# EAGLE design microtb_utfpr_v1 (EAGLE 9.6.2)
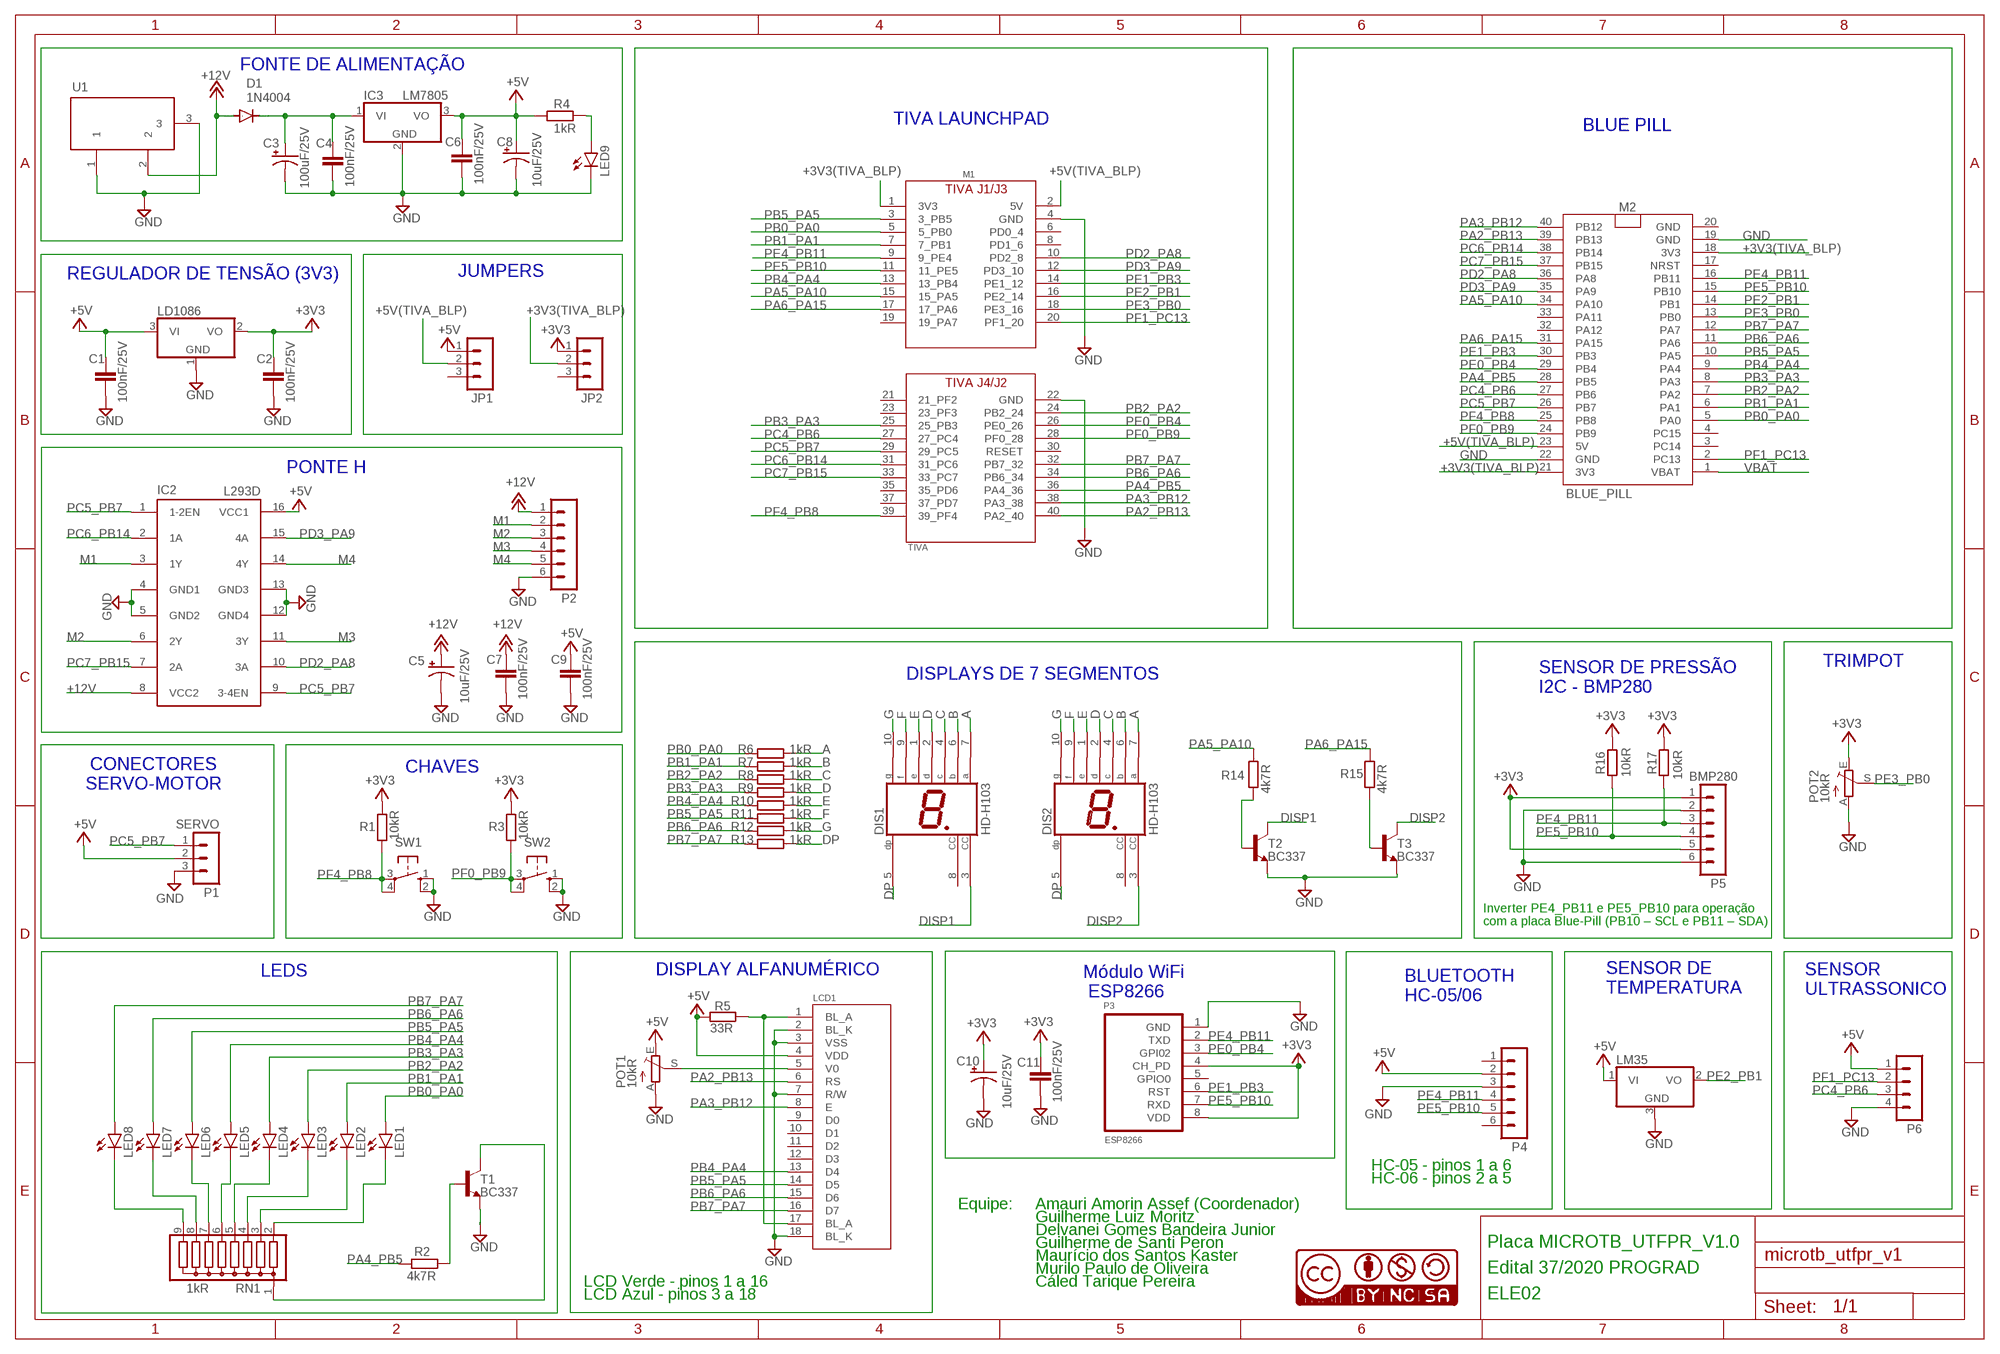
[diagram p0: schematic, sheet 1]

## Parts
C1  100nF/25V  C2.5/2  [C2.5-2]
C2  100nF/25V  C2.5/2  [C2.5-2]
C3  100uF/25V  CAPACITOR-PE2.5-7  [E2,5-7]
C4  100nF/25V  C2.5/2  [C2.5-2]
C5  10uF/25V  CAPACITOR-PE2.5-6  [E2,5-6]
C6  100nF/25V  C2.5/2  [C2.5-2]
C7  100nF/25V  C2.5/2  [C2.5-2]
C8  10uF/25V  CAPACITOR-PE2.5-6  [E2,5-6]
C9  100nF/25V  C2.5/2  [C2.5-2]
C10  10uF/25V  CAPACITOR-PE2.5-6  [E2,5-6]
C11  100nF/25V  C2.5/2  [C2.5-2]
D1  1N4004  [DO41-10]
DIS1  HD-H103  [HDSP-M]
DIS2  HD-H103  [HDSP-M]
IC1  LD1086  LD108605TV  [LD1086]
IC2  L293D  [DIL16]
IC3  LM7805  786TV  [TO220V]
JP1  JP  JUMP  [MA03-1]
JP2  JP  JUMP  [MA03-1]
LCD1  DISPLAY_LCDDISPLAY_LCD1  [DISPLAY_LCD_BL]
LED1  GREEN  LED3MM  [LED3MM]
LED2  GREEN  LED3MM  [LED3MM]
LED3  GREEN  LED3MM  [LED3MM]
LED4  GREEN  LED3MM  [LED3MM]
LED5  GREEN  LED3MM  [LED3MM]
LED6  GREEN  LED3MM  [LED3MM]
LED7  GREEN  LED3MM  [LED3MM]
LED8  GREEN  LED3MM  [LED3MM]
LED9  RED  LED3MM  [LED3MM]
M1  TIVA  [TIVA]
M2  BLUE_PILL  [BLUE_PILL]
P1  SERVO  CON3  [MA03-1]
P2  Motor  MA06-1  [HC_BLUETOOTH]
P3  ESP8266  [ESP8266]
P4  HC05_06  [HC_BLUETOOTH]
P5  BMP280  [BMP280]
P6  HC-04  HC-SR04US  [HS-04]
POT1  10kR  TRIM_EU-ELE02CA6V  [CA6V]
POT2  10kR  TRIM_EU-CIP20C-4MM  [CIP20C-4MM]
Q1  LM35L05Z  [LM35]
R1  10kR  R-EU_0204/7  [0204/7]
R2  4k7R  R-EU_0204/7  [0204/7]
R3  10kR  R-EU_0204/7  [0204/7]
R4  1kR  R-EU_0204/7  [0204/7]
R5  33R  R-EU_0204/7  [0204/7]
R6  1kR  R-EU_0204/7  [0204/7]
R7  1kR  R-EU_0204/7  [0204/7]
R8  1kR  R-EU_0204/7  [0204/7]
R9  1kR  R-EU_0204/7  [0204/7]
R10  1kR  R-EU_0204/7  [0204/7]
R11  1kR  R-EU_0204/7  [0204/7]
R12  1kR  R-EU_0204/7  [0204/7]
R13  1kR  R-EU_0204/7  [0204/7]
R14  4k7R  R-EU_0204/7  [0204/7]
R15  4k7R  R-EU_0204/7  [0204/7]
R16  10kR  R-EU_0204/7  [0204/7]
R17  10kR  R-EU_0204/7  [0204/7]
RN1  1kR  G08R  [SIL9]
SW1  SW  10-XX  [B3F-10XX]
SW2  SW  10-XX  [B3F-10XX]
T1  BC337  BC337-16-NPN-TO92-CBE  [TO92-CBE]
T2  BC337  BC337-16-NPN-TO92-CBE  [TO92-CBE]
T3  BC337  BC337-16-NPN-TO92-CBE  [TO92-CBE]
U1  POWERSUPPLY_DC21MMX  [POWERSUPPLY_DC-21MM]
U$1  CC-NC-BC  [CC-NC-BY]

## Nets
+3V3 [vcc]: C2.1 C10.+ C11.1 IC1.2(VO) JP2.1 P3.4(CH_PD) P3.8(VDD) P5.1 P5.5 POT2.E R1.2 R3.2 R16.2 R17.2
+3V3(TIVA_BLP) [vcctiva]: JP2.2 M1.1(3V3) M2.18(3V3) M2.21(3V3)
+5V [vcc]: C1.1 C6.1 C8.+ C9.1 IC1.3(VI) IC2.16(VCC1) IC3.3(VO) JP1.1 LCD1.4(VDD) P1.2 P4.2 P6.1 POT1.E Q1.1(VI) R4.1 R5.2
+5V(TIVA_BLP) [vcctiva]: JP1.2 M1.2(5V) M2.23(5V)
+12V [vcc]: C5.+ C7.1 D1.A IC2.8(VCC2) P2.1 U1.2
+V [vcc]: C3.+ C4.1 D1.C IC3.1(VI)
A: DIS1.7(A) DIS2.7(A) R6.1
B: DIS1.6(B) DIS2.6(B) R7.1
C: DIS1.4(C) DIS2.4(C) R8.1
D: DIS1.2(D) DIS2.2(D) R9.1
DISP1: DIS1.3(CC) T2.C
DISP2: DIS2.3(CC) T3.C
DP: DIS1.5(DP) DIS2.5(DP) R13.1
E: DIS1.1(E) DIS2.1(E) R10.1
F: DIS1.9(F) DIS2.9(F) R11.1
G: DIS1.10(G) DIS2.10(G) R12.1
GND [ground]: C1.2 C2.2 C3.- C4.2 C5.- C6.2 C7.2 C8.- C9.2 C10.- C11.2 IC1.1(GND) IC2.4(GND1) IC2.5(GND2) IC2.12(GND4) IC2.13(GND3) IC3.2(GND) LCD1.2(BL_K) LCD1.3(VSS) LCD1.7(R/W) LCD1.18(BL_K) LED9.K(C) M1.4(GND) M1.22(GND) M2.19(GND) M2.22(GND) P1.3 P2.6 P3.1(GND) P4.3 P5.2 P5.6 P6.4 POT1.A POT2.A Q1.3(GND) SW1.1(S) SW1.2(S1) SW2.1(S) SW2.2(S1) T1.E T2.E T3.E U1.1 U1.3
M1: IC2.3(1Y) P2.2
M2: IC2.6(2Y) P2.3
M3: IC2.11(3Y) P2.4
M4: IC2.14(4Y) P2.5
N$1: LED8.K(C) RN1.9
N$2: R14.1 T2.B
N$4: R15.1 T3.B
N$5 [vcc]: LED9.A R4.2
N$15: R2.2 T1.B
N$18: LED7.K(C) RN1.8
N$22: LED6.K(C) RN1.7
N$24: LED5.K(C) RN1.6
N$25: LED4.K(C) RN1.5
N$26: LED3.K(C) RN1.4
N$27: LED2.K(C) RN1.3
N$28: LED1.K(C) RN1.2
N$30: LCD1.1(BL_A) LCD1.17(BL_A) R5.1
N$31: RN1.1 T1.C
PA2_PB13: LCD1.6(RS) M1.40(PA2_40) M2.39(PB13)
PA3_PB12: LCD1.8(E) M1.38(PA3_38) M2.40(PB12)
PA4_PB5: M1.36(PA4_36) M2.28(PB5) R2.1
PA5_PA10: M1.15(15_PA5) M2.34(PA10) R14.2
PA6_PA15: M1.17(17_PA6) M2.31(PA15) R15.2
PB0_PA0: LED1.A M1.5(5_PB0) M2.5(PA0) R6.2
PB1_PA1: LED2.A M1.7(7_PB1) M2.6(PA1) R7.2
PB2_PA2: LED3.A M1.24(PB2_24) M2.7(PA2) R8.2
PB3_PA3: LED4.A M1.25(25_PB3) M2.8(PA3) R9.2
PB4_PA4: LCD1.13(D4) LED5.A M1.13(13_PB4) M2.9(PA4) R10.2
PB5_PA5: LCD1.14(D5) LED6.A M1.3(3_PB5) M2.10(PA5) R11.2
PB6_PA6: LCD1.15(D6) LED7.A M1.34(PB6_34) M2.11(PA6) R12.2
PB7_PA7: LCD1.16(D7) LED8.A M1.32(PB7_32) M2.12(PA7) R13.2
PC4_PB6: M1.27(27_PC4) M2.27(PB6) P6.3
PC5_PB7: IC2.1(1-2EN) IC2.9(3-4EN) M1.29(29_PC5) M2.26(PB7) P1.1
PC6_PB14: IC2.2(1A) M1.31(31_PC6) M2.38(PB14)
PC7_PB15: IC2.7(2A) M1.33(33_PC7) M2.37(PB15)
PD2_PA8: IC2.10(3A) M1.10(PD2_8) M2.36(PA8)
PD3_PA9: IC2.15(4A) M1.12(PD3_10) M2.35(PA9)
PE0_PB4: M1.26(PE0_26) M2.29(PB4) P3.3(GPI02)
PE1_PB3: M1.14(PE1_12) M2.30(PB3) P3.6(RST)
PE2_PB1: M1.16(PE2_14) M2.14(PB1) Q1.2(VO)
PE3_PB0: M1.18(PE3_16) M2.13(PB0) POT2.S
PE4_PB11: M1.9(9_PE4) M2.16(PB11) P3.2(TXD) P4.4 P5.3 R17.1
PE5_PB10: M1.11(11_PE5) M2.15(PB10) P3.7(RXD) P4.5 P5.4 R16.1
PF0_PB9: M1.28(PF0_28) M2.24(PB9) R3.1 SW2.3(P) SW2.4(P1)
PF1_PC13: M1.20(PF1_20) M2.2(PC13) P6.2
PF4_PB8: M1.39(39_PF4) M2.25(PB8) R1.1 SW1.3(P) SW1.4(P1)
VBAT [vcc]: M2.1(VBAT)
VO: LCD1.5(V0) POT1.S
Unconnected: DIS1.8(CC) DIS2.8(CC) JP1.3 JP2.3 LCD1.9(D0) LCD1.10(D1) LCD1.11(D2) LCD1.12(D3) M1.6(PD0_4) M1.8(PD1_6) M1.19(19_PA7) M1.21(21_PF2) M1.23(23_PF3) M1.30(RESET) M1.35(35_PD6) M1.37(37_PD7) M2.3(PC14) M2.4(PC15) M2.17(NRST) M2.20(GND) M2.32(PA12) M2.33(PA11) P3.5(GPIO0) P4.1 P4.6

## Notes on the sheet
- FONTE DE ALIMENTAÇÃO
- TIVA LAUNCHPAD
- BLUE PILL
- REGULADOR DE TENSÃO (3V3) | JUMPERS
- PONTE H
- TRIMPOT
- DISPLAYS DE 7 SEGMENTOS
- SENSOR DE PRESSÃO 
  I2C - BMP280
- CONECTORES 
  SERVO-MOTOR
- CHAVES
- Inverter PE4_PB11 e PE5_PB10 para operação
- com a placa Blue-Pill (PB10 – SCL e PB11 – SDA)
- LEDS | DISPLAY ALFANUMÉRICO
- SENSOR DE
  TEMPERATURA
- SENSOR
  ULTRASSONICO
- Módulo WiFi
   ESP8266
- BLUETOOTH
  HC-05/06
- HC-05 - pinos 1 a 6
- HC-06 - pinos 2 a 5
- Equipe: | Amauri Amorin Assef (Coordenador)
- Guilherme Luiz Moritz
- Delvanei Gomes Bandeira Junior
- Guilherme de Santi Peron | Placa MICROTB_UTFPR_V1.0
- Maurício dos Santos Kaster
- Murilo Paulo de Oliveira | Edital 37/2020 PROGRAD
- LCD Verde - pinos 1 a 16 | Cáled Tarique Pereira
- LCD Azul - pinos 3 a 18 | ELE02

## Library data of the parts
C1 C2 C4 C6 C7 C9 C11 = capacitor-wima:C: CAPACITOR naming: grid - package width
C3 C5 C8 C10 = BeagleBone_Blue_R3:CAPACITOR-P: POLARIZED CAPACITOR, American symbol
D1 = diode:1N4004: DIODE general purpose rectifier, 1 A
DIS1 DIS2 = display-hp:HD-H103: LED DISPLAY 1-character 7 segment, decimal point right; OC_FARNELL: unknown; OC_NEWARK: unknown
IC1 = ele02:LD1086: Positive VOLTAGE REGULATOR Source: http://cache.national.com/ds/LM/LM78L05.pdf http://www.fairchildsemi.com/ds/LM/LM7805.pdf
IC2 = st-microelectronics:L293D: PUSH-PULL 4 CHANNEL DRIVER; MPN: L293D; OC_FARNELL: 9589619; OC_NEWARK: 56P8249
IC3 = linear:78*: Positive VOLTAGE REGULATOR Source: http://cache.national.com/ds/LM/LM78L05.pdf http://www.fairchildsemi.com/ds/LM/LM7805.pdf
JP1 JP2 = ele02:JUMP: PIN HEADER; OC_FARNELL: unknown; OC_NEWARK: unknown
LCD1 = ele02:DISPLAY_LCD: LCD 16X2
LED1-LED9 = led:LED: LED OSRAM: - CHIPLED LG R971, LG N971, LY N971, LG Q971, LY Q971, LO R971, LY R971 LH N974, LH R974 LS Q976, LO Q976, LY Q976 LO Q996 - Hyper CHIPLED LW Q18S LB Q993, LB Q99A, LB R99A - SideLED LS A670, LO A670, LY A670, LG A670, LP A670 LB A673, LV A673, LT A673, LW A673 LH A674 LY A675 LS A676, LA A676, LO A676, LY A676, LW A676 LS A679, LY A679, LG A679 - Hyper Micro SIDELED® LS Y876, LA Y876, LO Y876, LY Y876 LT Y87S - SmartLED LW L88C, LW L88S LB L89C, LB L89S, LG L890 LS L89K, LO L89K, LY L89K LS L896, LA L896, LO L896, LY L896 - TOPLED LS T670, LO T670, LY T670, LG T670, LP T670 LSG T670, LSP T670, LSY T670, LOP T670, LYG T670 LG T671, LOG T671, LSG T671 LB T673, LV T673, LT T673, LW T673 LH T674 LS T676, LA T676, LO T676, LY T676, LB T676, LH T676, LSB T676, LW T676 LB T67C, LV T67C, LT T67C, LS T67K, LO T67K, LY T67K, LW E67C LS E67B, LA E67B, LO E67B, LY E67B, LB E67C, LV E67C, LT E67C LW T67C LS T679, LY T679, LG T679 LS T770, LO T770, LY T770, LG T770, LP T770 LB T773, LV T773, LT T773, LW T773 LH T774 LS E675, LA E675, LY E675, LS T675 LS T776, LA T776, LO T776, LY T776, LB T776 LHGB T686 LT T68C, LB T68C - Hyper Mini TOPLED® LB M676 - Mini TOPLED Santana® LG M470 LS M47K, LO M47K, LY M47K Source: http://www.osram.convergy.de LUXEON: - LUMILED® LXK2-PW12-R00, LXK2-PW12-S00, LXK2-PW14-U00, LXK2-PW14-V00 LXK2-PM12-R00, LXK2-PM12-S00, LXK2-PM14-U00 LXK2-PE12-Q00, LXK2-PE12-R00, LXK2-PE12-S00, LXK2-PE14-T00, LXK2-PE14-U00 LXK2-PB12-K00, LXK2-PB12-L00, LXK2-PB12-M00, LXK2-PB14-N00, LXK2-PB14-P00, LXK2-PB14-Q00 LXK2-PR12-L00, LXK2-PR12-M00, LXK2-PR14-Q00, LXK2-PR14-R00 LXK2-PD12-Q00, LXK2-PD12-R00, LXK2-PD12-S00 LXK2-PH12-R00, LXK2-PH12-S00 LXK2-PL12-P00, LXK2-PL12-Q00, LXK2-PL12-R00 Source: www.luxeon.com KINGBRIGHT: KA-3528ASYC Source: www.kingbright.com
M1 = ele02:TIVA: Conectores da placa Tiva Launch Pad
M2 = ele02:BLUE_PILL: Placa Blue Pill STM 32
P1 = ele02:CON3: PIN HEADER; OC_FARNELL: unknown; OC_NEWARK: unknown
P2 = ele02:MA06-1: PIN HEADER; OC_FARNELL: unknown; OC_NEWARK: unknown
P3 = ele02:ESP8266: ESP8266 IoT
P4 = ele02:HC05_06
P5 = ele02:BMP280: BMP280 Sensor
P6 = ele02:HC-SR04US: HC-SR04 Sensor de US; OC_FARNELL: unknown; OC_NEWARK: unknown
POT1 = ele02:TRIM_EU-ELE02: POTENTIOMETER
POT2 = ele02:TRIM_EU-: POTENTIOMETER
Q1 = ele02:LM35: Positive VOLTAGE REGULATOR Source: http://cache.national.com/ds/LM/LM78L05.pdf http://www.fairchildsemi.com/ds/LM/LM7805.pdf
R1-R17 = rcl:R-EU_: RESISTOR, European symbol; SPICEPREFIX: R
RN1 = resistor-sil:G08R: SIL RESISTOR; OC_FARNELL: unknown; OC_NEWARK: unknown
SW1 SW2 = ele02:10-XX: OMRON SWITCH; MPN: B3F-1000; OC_FARNELL: 176432; OC_NEWARK: 36M3542
T1-T3 = transistor:*-NPN-: NPN Transistror BF959 corrected 2008.03.06
U1 = ele02:POWERSUPPLY_DC21MM: Conector DC21MM
U$1 = cc-by-nc-sa:CC-NC-BC: All hardware is licensed under the Creative Commons Attribution-Noncommercial-Share Alike 2.5 Switzerland License. To view a copy of this license, visit http://creativecommons.org/licenses/by-nc-sa/2.5/ch/ or send a letter to Creative Commons, 171 Second Street, Suite 300, San Francisco, California, 94105, USA.

## Net classes
0 default: width 0.279 mm, drill 0.279 mm, clearance 0.305 mm
1 ground: width 0.889 mm, drill 0.889 mm, clearance 0.33 mm
2 vcc: width 0.889 mm, drill 0.889 mm, clearance 0.33 mm
3 vcctiva: width 0.889 mm, drill 0.889 mm, clearance 0.33 mm

## Board
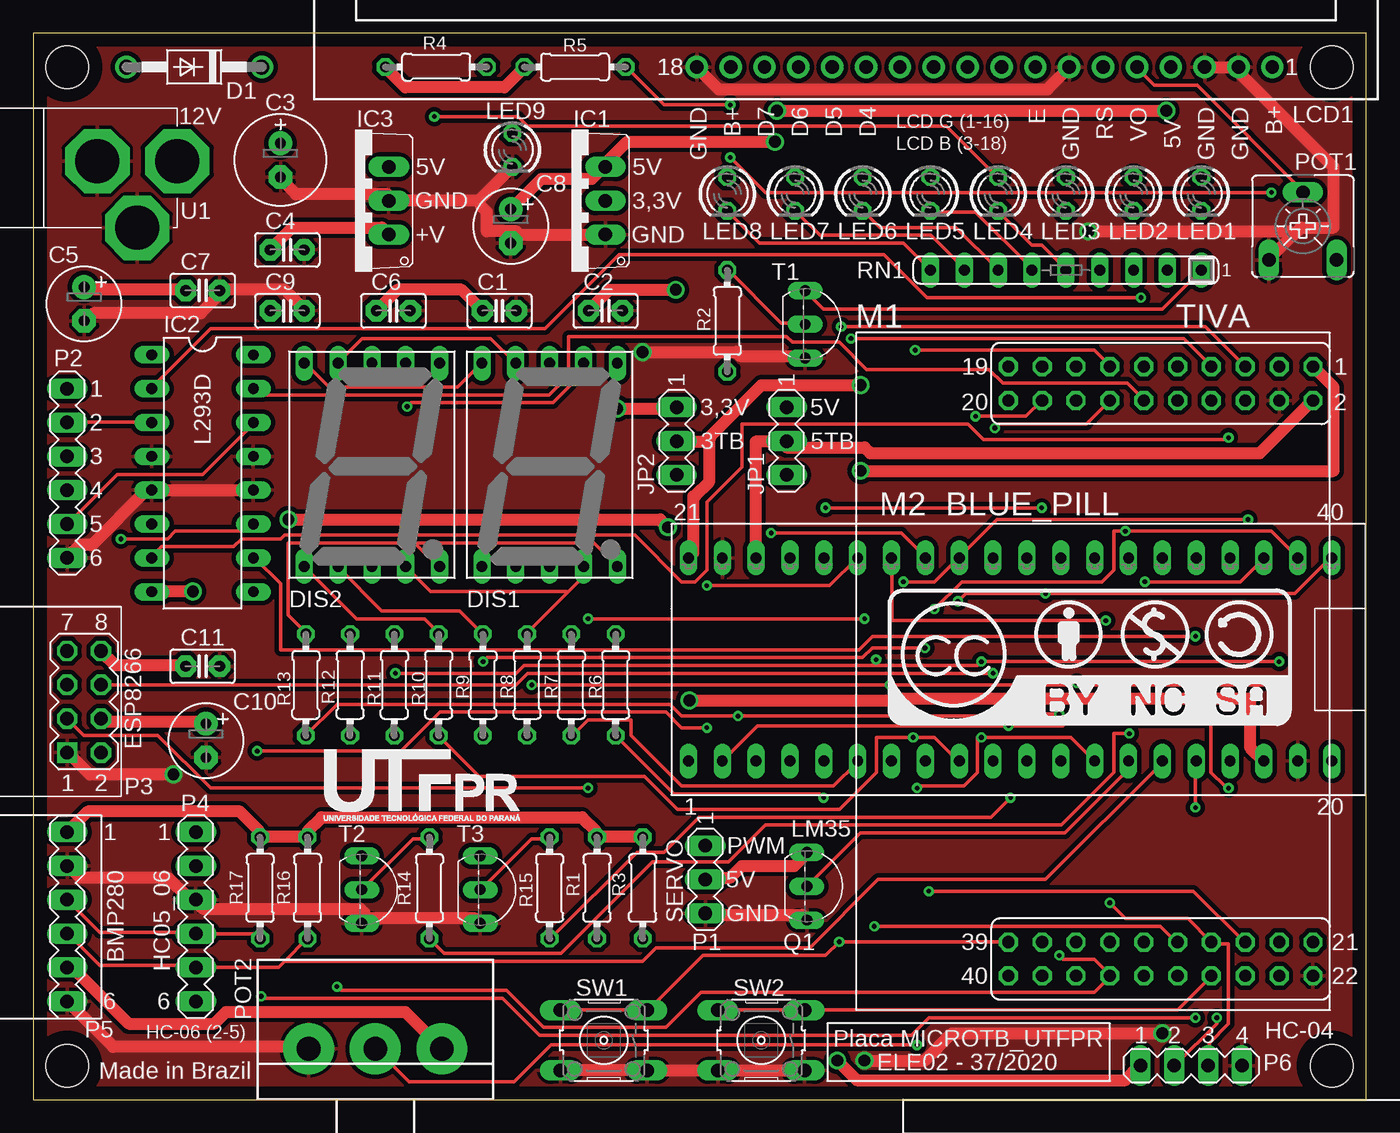
[diagram p1: board, top side]
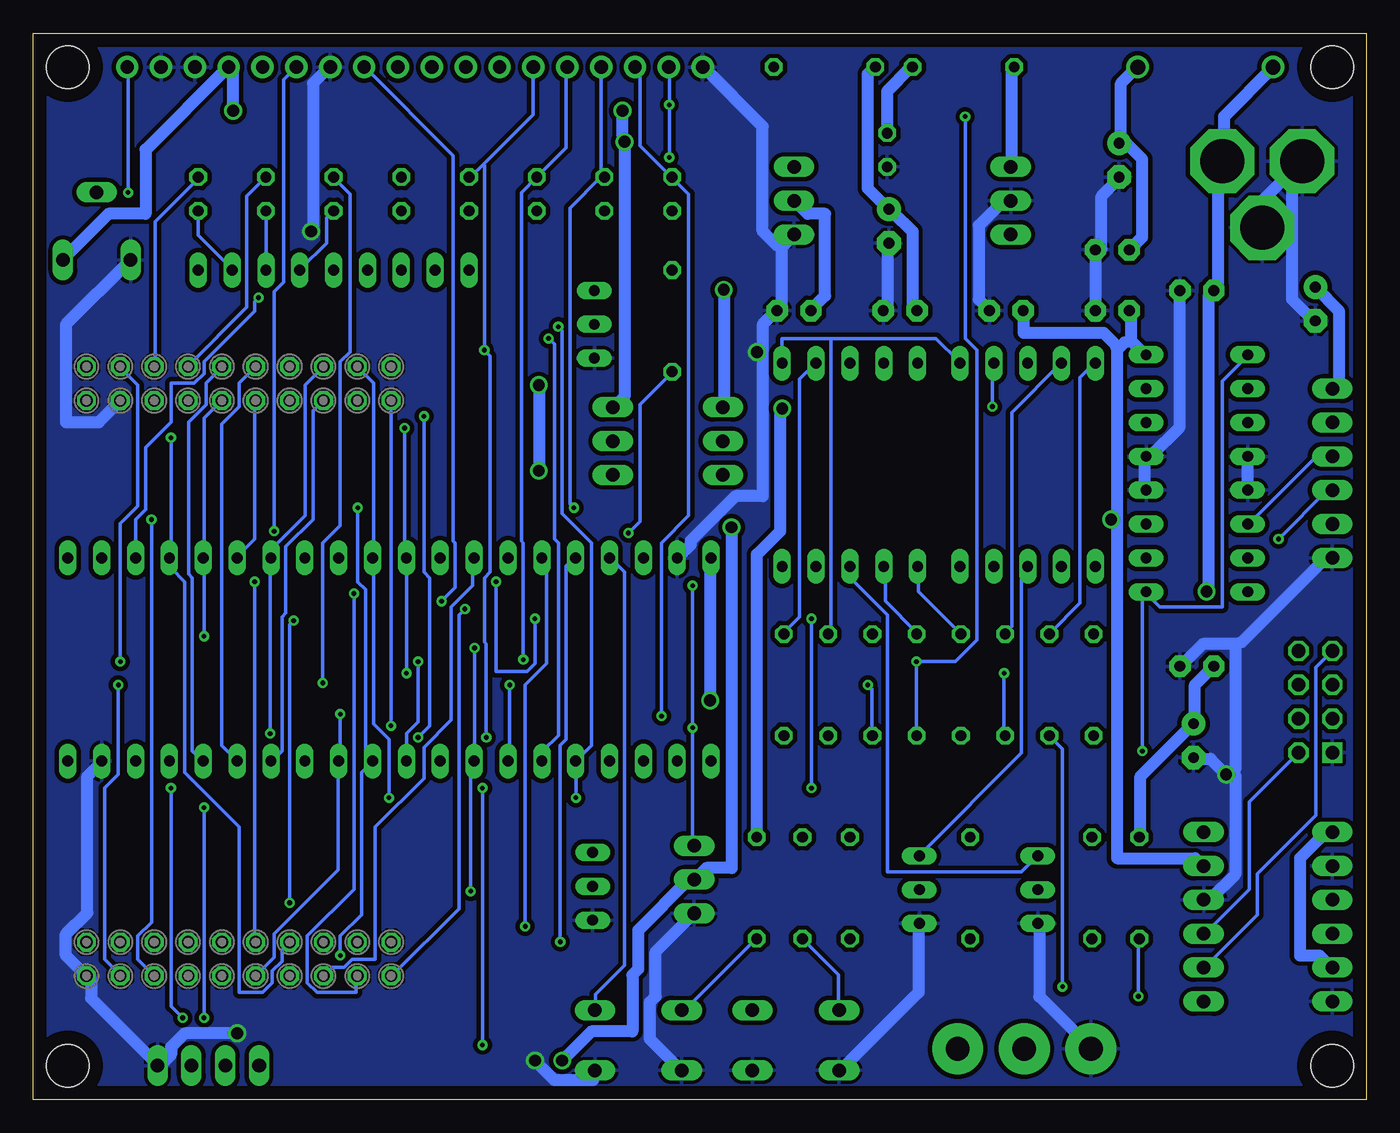
[diagram p2: board, bottom side, seen from below]

Size 100 x 80 mm. Coordinates in mm from the lower left corner, seen from the top.
Outline: 0,0 100,0 100,80 0,80 0,0
Copper layers (1*16): Top 0.035mm / dielectric 1.5mm / Bottom 0.035mm
Design rules "default": minimum track width 6mil, minimum drill 0.35mm, track to track 6mil, track to pad 6mil, pad to pad 6mil, via to via 6mil, smd to smd 6mil, copper to edge 40mil, drill to drill 6mil, minimum pad ring 10mil, minimum via ring 8mil, stop-mask expansion 4mil, vias tented up to drill 0mil, thermal gap 10mil
Holes 3.2 mm at 2.54,77.47 2.54,2.54 97.41,2.54 97.41,77.47

### Footprints (pad centres in the part's own frame; a part is rotated, then mirrored left to right if it is on the bottom)
C2.5-2 = drill 0.813 pad 1.6 octagon: 1 -1.27,0; 2 1.27,0
E2,5-7 = drill 0.813 pad 1.778: + -1.27,0 | drill 0.813 pad 1.778 octagon: - 1.27,0
E2,5-6 = drill 0.813 pad 1.778: + -1.27,0 | drill 0.813 pad 1.778 octagon: - 1.27,0
DO41-10 = drill 1.118: A 5.08,0; C -5.08,0
HDSP-M = drill 0.813 long: 1 -5.08,-7.62; 2 -2.54,-7.62; 3 0,-7.62; 4 2.54,-7.62; 5 5.08,-7.62; 6 5.08,7.62; 7 2.54,7.62; 8 0,7.62; 9 -2.54,7.62; 10 -5.08,7.62
LD1086 = drill 1.016 long: 1 -2.54,-2.54; 2 0,-2.54; 3 2.54,-2.54
DIL16 = drill 0.813 long: 1 -8.89,-3.81; 2 -6.35,-3.81; 3 -3.81,-3.81; 4 -1.27,-3.81; 5 1.27,-3.81; 6 3.81,-3.81; 7 6.35,-3.81; 8 8.89,-3.81; 9 8.89,3.81; 10 6.35,3.81; 11 3.81,3.81; 12 1.27,3.81; 13 -1.27,3.81; 14 -3.81,3.81; 15 -6.35,3.81; 16 -8.89,3.81
TO220V = drill 1.016 long: 1 -2.54,-2.54; 2 0,-2.54; 3 2.54,-2.54
MA03-1 = drill 1.016 long: 1 -2.54,0; 2 0,0; 3 2.54,0
DISPLAY_LCD_BL = drill 1 pad 1.676: 1 -32,15.5; 2 -29.46,15.5; 3 -26.92,15.5; 4 -24.38,15.5; 5 -21.84,15.5; 6 -19.3,15.5; 7 -16.76,15.5; 8 -14.22,15.5; 9 -11.68,15.5; 10 -9.14,15.5; 11 -6.6,15.5; 12 -4.06,15.5; 13 -1.52,15.5; 14 1.02,15.5; 15 3.56,15.5; 16 6.1,15.5; 17 8.64,15.5; 18 11.18,15.5
LED3MM = drill 0.813 octagon: A -1.27,0; K 1.27,0
TIVA = drill 0.914 octagon: 1 1.27,1.27; 2 1.27,3.81; 3 3.81,1.27; 4 3.81,3.81; 5 6.35,1.27; 6 6.35,3.81; 7 8.89,1.27; 8 8.89,3.81; 9 11.43,1.27; 10 11.43,3.81; 11 13.97,1.27; 12 13.97,3.81; 13 16.51,1.27; 14 16.51,3.81; 15 19.05,1.27; 16 19.05,3.81; 17 21.59,1.27; 18 21.59,3.81; 19 24.13,1.27; 20 24.13,3.81; 21 1.27,44.45; 22 1.27,46.99; 23 3.81,44.45; 24 3.81,46.99; 25 6.35,44.45; 26 6.35,46.99; 27 8.89,44.45; 28 8.89,46.99; 29 11.43,44.45; 30 11.43,46.99; 31 13.97,44.45; 32 13.97,46.99; 33 16.51,44.45; 34 16.51,46.99; 35 19.05,44.45; 36 19.05,46.99; 37 21.59,44.45; 38 21.59,46.99; 39 24.13,44.45; 40 24.13,46.99
BLUE_PILL = drill 0.813 long: 1 49.53,12.7; 2 46.99,12.7; 3 44.45,12.7; 4 41.91,12.7; 5 39.37,12.7; 6 36.83,12.7; 7 34.29,12.7; 8 31.75,12.7; 9 29.21,12.7; 10 26.67,12.7; 11 24.13,12.7; 12 21.59,12.7; 13 19.05,12.7; 14 16.51,12.7; 15 13.97,12.7; 16 11.43,12.7; 17 8.89,12.7; 18 6.35,12.7; 19 3.81,12.7; 20 1.27,12.7; 21 49.53,-2.54; 22 46.99,-2.54; 23 44.45,-2.54; 24 41.91,-2.54; 25 39.37,-2.54; 26 36.83,-2.54; 27 34.29,-2.54; 28 31.75,-2.54; 29 29.21,-2.54; 30 26.67,-2.54; 31 24.13,-2.54; 32 21.59,-2.54; 33 19.05,-2.54; 34 16.51,-2.54; 35 13.97,-2.54; 36 11.43,-2.54; 37 8.89,-2.54; 38 6.35,-2.54; 39 3.81,-2.54; 40 1.27,-2.54
HC_BLUETOOTH = drill 1.016 long: 1 -6.35,0; 2 -3.81,0; 3 -1.27,0; 4 1.27,0; 5 3.81,0; 6 6.35,0
ESP8266 = drill 1.016 square: 1 1.27,3.81 | drill 1.016 octagon: 2 1.27,1.27; 3 3.81,3.81; 4 3.81,1.27; 5 6.35,3.81; 6 6.35,1.27; 7 8.89,3.81; 8 8.89,1.27
BMP280 = drill 1.016 long: 1 13.97,1.27; 2 11.43,1.27; 3 8.89,1.27; 4 6.35,1.27; 5 3.81,1.27; 6 1.27,1.27
HS-04 = drill 1.016 long: 1 -3.81,0; 2 -1.27,0; 3 1.27,0; 4 3.81,0
CA6V = drill 1.016 long: A -2.54,-2.54; E 2.54,-2.54; S 0,2.54
CIP20C-4MM = drill 1.778 pad 3.81: A -5,0; E 5,0; S 0,0
LM35 = drill 0.813 long: 1 0,2.54; 2 2.54,2.54; 3 5.08,2.54
0204/7 = drill 0.813 octagon: 1 -3.81,0; 2 3.81,0
SIL9 = drill 0.813 long: 1 -10.16,0; 2 -7.62,0; 3 -5.08,0; 4 -2.54,0; 5 0,0; 6 2.54,0; 7 5.08,0; 8 7.62,0; 9 10.16,0
B3F-10XX = drill 1.016 long: 1 -3.251,2.261; 2 3.251,2.261; 3 -3.251,-2.261; 4 3.251,-2.261
TO92-CBE = drill 0.813 long: B 0,0; C -2.54,0; E 2.54,0
POWERSUPPLY_DC-21MM = drill 3.302 pad 4.826 octagon: 1 -5.08,-3.353; 2 -0.076,-6.35; 3 -0.076,-0.356

### Placement (x,y rotation side)
C1  34.97,59.18 0 top
C2  42.93,59.18 0 top
C3  18.54,70.48 270 top
C4  19.05,63.75 0 top
C5  3.81,59.69 270 top
C6  27.01,59.18 0 top
C7  12.7,60.71 0 top
C8  35.81,65.53 270 top
C9  19.05,59.18 0 top
C10  12.95,26.92 270 top
C11  12.7,32.51 0 top
D1  12.06,77.47 180 top
DIS1  38.73,47.62 0 top
DIS2  25.4,47.62 0 top
IC1  40.39,67.44 90 top
IC2  12.7,46.99 270 top
IC3  24.13,67.44 90 top
JP1  56.52,49.4 270 top
JP2  48.26,49.4 270 top
LCD1  60.96,92.96 180 top
LED1  87.63,67.94 270 top
LED2  82.55,67.94 270 top
LED3  77.47,67.94 270 top
LED4  72.39,67.94 270 top
LED5  67.31,67.94 270 top
LED6  62.23,67.94 270 top
LED7  57.15,67.94 270 top
LED8  52.07,67.94 270 top
LED9  35.94,71.25 270 top
M1  97.28,56.26 180 top
M2  98.68,38.1 180 top
P1  50.42,16.51 270 top
P2  2.54,46.99 270 top
P3  6.35,24.77 90 top
P4  12.19,13.72 270 top
P5  3.81,6.1 90 top
P6  86.87,2.54 0 top
POT1  95.25,65.53 0 top
POT2  25.65,3.81 0 top
Q1  55.5,18.54 270 top
R1  42.29,15.88 90 top
R2  52.07,58.42 90 top
R3  45.72,15.88 90 top
R4  30.23,77.47 0 top
R5  40.64,77.47 180 top
R6  43.69,31.11 270 top
R7  40.37,31.11 270 top
R8  37.05,31.11 270 top
R9  33.73,31.11 270 top
R10  30.41,31.11 270 top
R11  27.09,31.11 270 top
R12  23.77,31.11 270 top
R13  20.45,31.11 270 top
R14  29.72,15.88 270 top
R15  38.73,15.88 270 top
R16  20.57,15.88 90 top
R17  17.02,15.88 90 top
RN1  77.47,62.23 180 top
SW1  42.8,4.45 180 top
SW2  54.61,4.45 180 top
T1  57.91,58.17 270 top
T2  24.64,15.75 270 top
T3  33.53,15.75 270 top
U1  4.45,70.48 90 top
U$1  64.26,28.19 0 top

### Tracks (layer width: path | path; a pad name or v marks a point on that pad's centre or on a via)
+3V3  (via drill 0.89)
  Top 0.889: v48.2,60.76 43.23,60.76 41.77,59.3 C2.1 | P3.8 5.11,33.59 6.13,32.57 11.39,32.57 C11.1 | P3.4 5.11,28.48 5.26,28.33 12.85,28.33 C10.+ | R3.2 45.71,19.72 42.35,19.72 R1.2 42.21,20.16 41.19,21.18 21.61,21.18 20.59,20.16 R16.2 20.45,19.72 17.09,19.72 R17.2 16.94,20.16 15.48,21.61 4.09,21.61 P5.1 | POT2.E 30.52,3.94 27.9,6.57 14.46,6.57 13.58,5.7 7.16,5.7 3.07,9.79 2.63,9.79 P5.5 | v43.81,51.85 48.2,51.85 JP2.1
  Bottom 0.889: v48.2,60.76 48.2,51.99 JP2.1 | IC1.2 42.79,67.33 41.92,66.45 40.6,66.45 40.6,60.32 41.62,59.3 C2.1 | C11.1 11.54,32.42 12.85,31.11 12.85,28.33 C10.+ 13.29,27.9 16.94,24.24 16.94,19.72 R17.2 | P5.5 2.63,9.93 3.5,10.81 4.97,10.81 4.97,18.11 3.07,20.01 2.63,20.01 P5.1 | v43.81,51.85 43.96,51.7 43.96,42.65 45.71,40.89 45.71,19.72 R3.2
+3V3(TIVA_BLP)  (via drill 0.89)
  Top 0.889: 50.68,49.37 50.68,46.3 49.66,45.28 49.51,45.28 49.51,41.04 49.22,40.75 M2.21 | 50.68,49.37 48.34,49.37 JP2.2 | v49.22,29.94 64.85,29.94 64.99,30.09 91.28,30.09 91.28,26.43 92.3,25.41 M2.18 | v62.07,47.17 97.56,47.17 97.56,53.45 96.1,54.91 M1.1 | v62.07,53.6 54.62,53.6 50.83,49.8 50.68,49.37
  Bottom 0.889: v49.22,29.94 49.22,40.6 M2.21 | v62.07,53.6 v62.07,47.17
+5V  (via drill 0.89)
  Top 0.889: Q1.1 57.98,18.4 57.11,17.53 53.16,17.53 52.29,16.65 50.53,16.65 P1.2 | v60.32,2.92 61.78,1.46 81.93,1.46 82.96,2.48 P6.1 | C6.1 25.85,59.3 27.31,60.76 32.13,60.76 33.59,59.3 C1.1 | C8.+ 35.93,66.89 38.12,69.08 41.92,69.08 42.79,69.96 IC1.3 43.09,70.4 44.55,71.86 v55.65,71.86 | R4.1 26.43,77.41 27.9,75.95 35.34,75.95 36.8,77.41 R5.2 | v55.79,74.19 v85,74.19 | v47.61,42.94 47.03,43.52 v19.13,43.52
  Bottom 0.889: v60.32,2.92 58.13,5.11 55.06,5.11 55.06,9.35 54.62,9.79 54.62,12.71 50.83,16.5 50.53,16.5 P1.2 50.09,16.8 49.51,17.38 47.61,17.38 v47.61,42.94 | 17.67,56.96 16.65,55.94 IC2.16 | 17.67,56.96 17.67,59.15 C9.1 | 18.69,56.23 18.69,43.52 | 18.69,43.52 18.69,18.11 12.85,18.11 12.27,17.53 P4.2 | 18.69,56.23 18.11,56.81 17.67,56.96 | POT1.E 97.71,63.09 94.35,66.45 91.57,66.45 91.57,71.27 85.44,77.41 LCD1.4 85,77.26 v85,74.19 | R4.1 26.43,77.41 26.58,77.26 26.58,70.1 IC3.3 | R5.2 36.95,77.41 37.39,76.97 37.39,68.35 35.93,66.89 C8.+ 35.49,66.6 34.03,65.14 34.03,59.59 33.74,59.3 C1.1 | JP1.1 56.38,51.99 55.65,52.72 v55.65,71.86 55.79,72.3 v55.79,74.19 | 18.69,56.23 18.84,56.67 19.72,57.54 25.7,57.54 25.7,59.15 C6.1 | v19.13,43.52 18.69,43.52
+5V(TIVA_BLP)
  Top 0.889: M2.23 54.19,40.75 54.19,49.37 56.38,49.37 JP1.2 56.52,48.93 62.36,48.93 62.8,48.49 92.01,48.49 95.95,52.43 M1.2
+12V  (via drill 0.89)
  Top 0.889: v11.98,38.12 8.91,38.12 IC2.8 | C5.+ 3.94,60.9 4.09,60.76 11.39,60.76 C7.1
  Bottom 0.889: D1.A 7.01,77.41 10.66,73.75 10.66,70.54 U1.2 11.1,70.1 11.1,60.9 C7.1 11.54,60.61 11.83,60.32 11.83,38.27 v11.98,38.12 | P2.1 2.48,53.45 2.04,53.89 2.04,59.15 3.8,60.9 C5.+
+V
  Top 0.889: IC3.1 26.58,64.99 26.14,65.43 19.43,65.43 17.82,63.82 C4.1
  Bottom 0.889: D1.C 17.23,77.41 18.4,76.24 18.4,71.86 C3.+ 17.96,71.71 16.8,70.54 16.8,64.7 17.67,63.82 C4.1
A  (via drill 0.35)
  Top 0.279: v28.04,51.99 28.33,52.29 38.99,52.29 41.19,54.48 41.19,55.21 DIS1.7
  Bottom 0.279: R6.1 43.67,35.05 42.5,36.22 42.5,54.04 41.33,55.21 DIS1.7 | v28.04,51.99 28.04,55.21 DIS2.7
B
  Bottom 0.279: 40.16,57.11 43.81,57.11 DIS1.6 | 40.16,57.11 32.28,57.11 30.52,55.35 DIS2.6 | 40.16,57.11 40.16,35.2 40.31,35.05 R7.1
C
  Top 0.279: 40.09,38.05 41.19,39.14 41.19,39.87 DIS1.4 | 40.09,38.05 37.1,35.05 R8.1 | DIS2.4 28.04,39.87 29.79,38.12 40.02,38.12 40.09,38.05
D
  Top 0.279: DIS2.2 22.93,39.87 26.14,36.66 31.98,36.66 33.59,35.05 R9.1
  Bottom 0.279: R9.1 33.74,35.05 36.07,37.39 36.07,39.87 DIS1.2
DISP1
  Bottom 0.279: T2.C 24.68,18.26 25.85,17.09 35.93,17.09 35.93,36.37 38.7,39.14 38.7,39.87 DIS1.3
DISP2
  Bottom 0.279: DIS2.3 25.41,39.87 25.85,39.43 25.85,26 33.45,18.4 T3.C
DP
  Top 0.279: 28.7,41.7 30.38,40.02 DIS2.5 | 28.7,41.7 28.63,41.77 19.13,41.77 19.13,36.37 20.45,35.05 R13.1 | DIS1.5 42.06,41.77 28.77,41.77 28.7,41.7
E
  Top 0.279: DIS2.1 20.45,39.87 24.24,36.07 29.36,36.07 30.38,35.05 R10.1
  Bottom 0.279: R10.1 30.52,35.05 33.59,38.12 33.59,39.87 DIS1.1
F
  Top 0.279: DIS2.9 22.93,55.35 24.68,57.11 34.32,57.11 36.07,55.35 DIS1.9
  Bottom 0.279: R11.1 27.02,35.05 26.58,35.49 26.58,51.56 22.93,55.21 DIS2.9
G
  Top 0.279: DIS1.10 33.59,55.21 31.84,53.45 22.2,53.45 20.45,55.21 DIS2.10
  Bottom 0.279: R12.1 23.66,35.05 21.47,37.24 21.47,54.19 20.45,55.21 DIS2.10
GND  (via drill 0.89)
  Top 0.889: Q1.3 57.98,13.58 57.69,13.88 50.53,13.88 P1.3 | SW1.2 39.58,2.19 46.01,2.19 SW1.1 46.44,2.19 51.26,2.19 SW2.2 51.7,2.19 57.84,2.19 SW2.1 | v84.71,4.97 68.94,4.97 66.89,2.92 v62.36,2.92 | P5.6 2.63,7.3 5.99,3.94 20.59,3.94 POT2.A | v10.52,24.39 4.24,24.39 2.63,26 P3.1 | 24.98,13.58 24.68,13.29 T2.E | 24.98,13.58 33.15,13.58 T3.E | P5.2 2.63,17.53 3.5,16.65 10.08,16.65 11.68,15.04 12.12,15.04 P4.3 12.41,14.61 12.71,14.31 24.54,14.31 24.83,14.02 24.98,13.58 | P2.6 2.63,40.75 3.5,41.62 4.38,41.62 8.47,45.71 8.76,45.71 IC2.5 9.2,45.71 IC2.12 | C9.2 20.3,59.3 18.84,60.76 14.02,60.76 C7.2 13.88,60.32 12.56,59 4.53,59 3.94,58.42 C5.- | LCD1.3 87.92,77.41 90.41,77.41 LCD1.2 90.55,76.97 97.56,69.96 97.56,65.43 95.08,65.43 94.49,64.85 | 94.49,64.85 92.74,63.09 POT1.A | 33.45,67.47 35.93,69.96 LED9.K | 33.45,67.47 26.73,67.47 IC3.2 26.58,67.91 19.72,67.91 18.55,69.08 C3.- | v45.71,56.08 52.72,56.08 53.02,55.79 57.69,55.79 57.84,55.65 T1.E | LCD1.7 77.7,77.41 76.09,75.8 51.41,75.8 49.8,77.41 LCD1.18 | 36.51,64.85 35.93,64.26 C8.- | 36.51,64.85 42.79,64.85 IC1.1 | 33.45,67.47 33.59,67.04 34.03,66.6 34.03,65.14 36.22,65.14 36.51,64.85 | v79.16,65.14 94.2,65.14 94.49,64.85
  Bottom 0.889: M2.19 94.93,25.27 95.95,24.24 95.95,14.02 97.56,12.41 97.56,10.81 96.1,9.35 M1.22 95.66,9.05 95.66,7.59 90.7,2.63 P6.4 90.26,2.77 89.67,3.36 89.67,3.94 88.65,4.97 v84.71,4.97 | P1.3 50.53,13.88 53.31,11.1 53.31,7.74 53.75,7.3 53.75,4.53 51.41,2.19 SW2.2 | v62.36,2.92 60.9,1.46 57.98,1.46 57.98,2.04 SW2.1 | C10.- 12.85,25.56 11.68,25.56 v10.52,24.39 10.08,24.54 | 9.79,34.18 12.27,34.18 13.88,32.57 C11.2 | 9.79,34.18 9.79,24.83 10.08,24.54 | 10.08,24.54 9.79,24.24 9.79,16.94 11.68,15.04 12.12,15.04 P4.3 | POT2.A 20.74,3.94 24.54,7.74 24.54,13.14 T2.E | U1.1 7.74,65.43 7.74,67.47 4.82,70.4 U1.3 5.55,69.08 5.55,60.03 3.94,58.42 C5.- | IC2.12 16.65,45.86 16.65,48.2 IC2.13 16.07,48.34 14.02,50.39 14.02,60.61 C7.2 | IC2.5 8.91,45.86 8.91,48.2 IC2.4 | C9.2 20.3,59.3 20.3,63.68 C4.2 19.86,63.82 19.86,67.77 18.55,69.08 C3.- | M1.4 93.47,52.43 95.08,50.83 97.56,50.83 97.56,58.13 92.74,62.95 POT1.A | C6.2 28.33,59.3 29.06,60.03 29.06,65.58 27.31,67.33 26.73,67.33 IC3.2 | C1.2 36.22,59.3 35.93,59.59 35.93,64.26 C8.- | 45.28,56.08 45.28,58.13 44.25,59.15 C2.2 43.81,59.3 43.81,63.97 | 45.28,56.08 45.28,45.28 47.32,45.28 50.68,41.92 50.68,41.62 51.56,40.75 M2.22 | v45.71,56.08 45.28,56.08 | 43.81,63.97 42.94,64.85 IC1.1 | LCD1.18 49.66,77.41 45.28,73.03 45.28,65.14 44.25,64.12 43.81,63.97 | v79.16,65.14 79.01,65.28 79.01,76.24 77.84,77.41 LCD1.7 | 9.79,34.18 9.35,34.32 3.07,40.6 2.63,40.6 P2.6 | SW1.2 39.43,2.19 33.59,8.03 33.59,13.14 T3.E
  pour Bottom: 0,0 100.08,0 100.08,80.01 0,80.01
  pour Top: 0,0 100.08,0 100.08,80.01 0,80.01
M1
  Top 0.279: IC2.3 8.76,50.83 2.63,50.83 P2.2
M2
  Bottom 0.279: IC2.6 8.76,43.23 3.8,48.2 2.63,48.2 P2.3
M3  (via drill 0.35)
  Top 0.279: v6.57,42.06 10.08,42.06 10.66,42.65 16.07,42.65 16.5,43.09 IC2.11
  Bottom 0.279: v6.57,42.06 2.92,45.71 2.63,45.71 P2.4
M4
  Top 0.279: IC2.14 16.5,50.68 12.71,46.88 6.28,46.88 2.63,43.23 P2.5
N$1
  Top 0.279: RN1.9 67.18,62.36 65.28,64.26 54.48,64.26 52.14,66.6 LED8.K
N$2
  Top 0.279: T2.B 24.68,15.77 28.48,19.57 29.65,19.57 R14.1
N$4
  Top 0.279: T3.B 33.59,15.77 37.39,19.57 38.7,19.57 R15.1
N$5
  Bottom 0.889: R4.2 34.18,77.41 35.93,75.65 35.93,72.59 LED9.A
N$15
  Top 0.279: R2.2 52.14,62.22 56.08,58.27 57.84,58.27 T1.B
N$18
  Top 0.279: RN1.8 69.81,62.36 67.33,64.85 59,64.85 57.25,66.6 LED7.K
N$22
  Top 0.279: RN1.7 72.3,62.36 69.23,65.43 63.53,65.43 62.36,66.6 LED6.K
N$24
  Top 0.279: RN1.6 74.92,62.36 70.69,66.6 67.33,66.6 LED5.K
N$25
  Top 0.279: LED4.K 72.44,66.6 74.92,64.12 75.65,64.12 77.41,62.36 RN1.5
N$26
  Bottom 0.279: LED3.K 77.55,66.6 77.99,66.16 77.99,64.26 79.89,62.36 RN1.4
N$27
  Bottom 0.279: RN1.3 82.52,62.36 82.52,66.6 LED2.K
N$28
  Bottom 0.279: LED1.K 87.63,64.85 85.15,62.36 RN1.2
N$30  (via drill 0.35)
  Top 0.279: v52.29,74.63 47.32,74.63 44.55,77.41 R5.1 | v92.89,68.06 54.91,68.06 v52.29,70.69
  Bottom 0.279: LCD1.17 52.29,77.41 v52.29,74.63 v52.29,70.69 | v92.89,68.06 92.89,77.41 LCD1.1
N$31
  Top 0.279: T1.C 57.98,60.61 59.3,59.3 84.71,59.3 87.63,62.22 RN1.1
PA2_PB13  (via drill 0.35)
  Top 0.279: M2.39 94.79,40.75 92.89,42.65 v81.93,42.65 81.06,42.65 81.06,39.73 80.18,38.85 69.67,38.85 v67.62,36.8
  Bottom 0.279: v81.93,42.65 81.93,60.61 81.2,61.34 81.2,76.53 80.33,77.41 LCD1.6 | v67.62,36.8 68.06,36.37 68.06,14.31 73.03,9.35 M1.40
PA3_PB12  (via drill 0.35)
  Top 0.279: M2.40 97.27,40.6 94.64,37.97 v75.95,37.97 69.96,37.97 v69.37,37.39
  Bottom 0.279: v75.95,37.97 75.95,15.77 79.45,12.27 79.45,8.76 78.72,8.03 75.8,8.03 75.8,9.2 M1.38 | v69.37,37.39 68.35,38.41 68.35,41.77 68.5,41.92 68.5,70.83 75.07,77.41 LCD1.8
PA4_PB5  (via drill 0.35)
  Top 0.279: v55.35,42.5 65.14,42.5 66.89,40.75 M2.28
  Bottom 0.279: v55.35,42.5 54.48,43.38 54.48,52.14 52.14,54.48 R2.1 | M1.36 78.14,9.35 77.55,9.93 76.68,9.93 76.09,10.52 74.34,10.52 74.34,20.45 70.69,24.1 70.69,26.43 68.64,28.48 68.64,36.95 67.04,38.56 67.04,40.6 M2.28
PA5_PA10  (via drill 0.35)
  Top 0.279: v82.23,27.46 81.06,27.46 81.06,24.54 77.11,20.59 54.91,20.59 52.14,17.82 46.44,17.82 39.58,10.95 30.82,10.95 29.79,11.98 R14.2
  Bottom 0.279: v82.23,27.46 82.23,40.6 M2.34 82.08,40.75 82.08,41.33 79.6,43.81 79.6,53.6 78.28,54.91 M1.15
PA6_PA15  (via drill 0.35)
  Top 0.279: v73.32,22.64 71.86,21.18 49.95,21.18 47.32,18.55 45.28,18.55 38.85,12.12 R15.2
  Bottom 0.279: v73.32,22.64 73.32,27.02 74.49,28.19 74.49,40.6 M2.31 74.49,40.75 74.49,53.75 75.65,54.91 M1.17
PB0_PA0  (via drill 0.35)
  Top 0.279: v59.3,22.64 59,22.93 48.05,22.93 43.81,27.16 R6.2 | v60.61,57.98 87.92,57.98 90.84,55.06 M1.5
  Bottom 0.279: LED1.A 87.63,69.08 90.84,65.87 90.84,55.06 M1.5 | v59.3,22.64 59.3,25.27 M2.5 58.13,26.58 58.13,41.77 60.32,43.96 60.32,57.69 v60.61,57.98
PB1_PA1  (via drill 0.35)
  Top 0.279: M2.6 61.78,25.27 60.03,23.51 48.63,23.51 44.84,27.31 44.84,28.48 41.62,28.48 40.46,27.31 R7.2 | v61.34,57.11 86.32,57.11 88.36,55.06 M1.7
  Bottom 0.279: LED2.A 82.66,69.08 83.98,67.77 83.98,59.44 88.36,55.06 M1.7 | v61.34,57.11 60.9,56.67 60.9,42.06 60.61,41.77 60.61,27.31 61.78,26.14 61.78,25.41 M2.6
PB2_PA2  (via drill 0.35)
  Top 0.279: v37.39,31.11 v64.26,31.11 78.14,31.11 v78.28,31.25 78.28,31.11 v93.62,31.11
  Bottom 0.279: v64.26,31.11 64.26,25.41 M2.7 | v37.39,31.11 37.1,30.82 37.1,27.31 R8.2 | v78.28,31.25 78.28,41.77 76.97,43.09 76.97,55.35 76.24,56.08 76.24,67.91 77.41,69.08 LED3.A | v93.62,31.11 93.62,24.39 94.64,23.37 94.64,10.52 93.47,9.35 M1.24
PB3_PA3  (via drill 0.35)
  Top 0.279: v33.74,32.86 34.03,33.15 62.22,33.15 62.95,33.88 v66.89,33.88 | v30.09,73.75 36.37,73.75 37.1,73.03 68.5,73.03 72.3,69.23 LED4.A | v67.18,15.63 87.05,15.63 90.84,11.83 M1.25
  Bottom 0.279: v66.89,33.88 66.89,25.41 M2.8 67.04,25.27 67.18,25.12 v67.18,15.63 | R9.2 v33.74,32.86 30.82,32.86 29.21,34.47 29.21,56.23 30.09,57.11 v30.09,73.75
PB4_PA4  (via drill 0.35)
  Top 0.279: v66.16,56.23 79.6,56.23 80.77,55.06 M1.13 | R10.2 30.52,27.16 33.45,24.24 45.86,24.24 48.34,21.76 60.47,21.76 63.24,24.54 63.24,27.16 v66.02,27.16 67.62,27.16 69.37,25.41 M2.9
  Bottom 0.279: 66.23,70.18 62.51,73.9 62.51,77.41 LCD1.13 | 66.23,70.18 67.18,69.23 LED5.A | 66.23,70.18 66.16,70.1 v66.16,56.23 65.72,55.79 65.72,39.58 66.16,39.14 66.16,34.32 66.02,34.18 v66.02,27.16
PB5_PA5  (via drill 0.35)
  Top 0.279: v27.16,31.98 36.22,31.98 36.8,32.57 63.24,32.57 | 63.24,32.57 70.83,32.57 v71.13,32.86 v93.47,32.86 | 63.24,32.57 v63.24,33.01
  Bottom 0.279: LCD1.14 60.03,77.41 60.03,71.42 LED6.A 63.39,68.06 63.39,41.92 63.24,41.77 v63.24,33.01 | v27.16,31.98 27.16,27.31 R11.2 | v71.13,32.86 71.13,28.33 72,27.46 72,25.41 M2.10 | v93.47,32.86 93.47,43.23 92.16,44.55 92.16,53.6 93.47,54.91 M1.3
PB6_PA6  (via drill 0.35)
  Top 0.279: v76.97,10.81 77.26,10.52 79.6,10.52 80.77,9.35 M1.34 80.77,9.2 79.6,8.03 50.09,8.03 47.47,5.4 38.27,5.4 35.49,8.18 23.08,8.18 v22.78,8.47 | v75.65,44.4 v59.44,44.4
  Bottom 0.279: LCD1.15 57.4,77.41 57.4,69.37 57.25,69.23 LED7.A 57.4,69.23 59.73,66.89 59.73,44.69 v59.44,44.4 | v76.97,10.81 76.97,12.27 75.36,13.88 75.36,24.54 74.63,25.27 M2.11 75.07,24.98 75.07,38.27 75.65,38.85 v75.65,44.4 | v22.78,8.47 22.78,26.29 23.66,27.16 R12.2
PB7_PA7  (via drill 0.35)
  Top 0.279: v76.97,28.92 72.88,28.92 72.73,28.77 v52.87,28.77 48.63,28.77 47.76,29.65 22.78,29.65 R13.2
  Bottom 0.279: LCD1.16 54.77,77.41 54.48,77.11 54.48,71.56 52.14,69.23 LED8.A 51.99,69.08 50.83,67.91 50.83,43.81 52.87,41.77 v52.87,28.77 | v76.97,28.92 76.97,25.41 M2.12 77.11,25.27 77.11,17.23 81.93,12.41 81.93,10.66 83.25,9.35 M1.32
PC4_PB6  (via drill 0.35)
  Top 0.279: v80.47,35.93 64.41,35.93 64.41,40.6 M2.27 | v80.77,14.75 81.93,13.58 86.61,13.58 88.36,11.83 M1.27 88.51,11.68 89.67,11.68 89.67,5.7 88.21,4.24 88.21,2.63 P6.3
  Bottom 0.279: v80.47,35.93 80.77,35.64 v80.77,14.75
PC5_PB7  (via drill 0.35)
  Top 0.279: v50.53,38.56 59.73,38.56 61.78,40.6 M2.26 | v63.09,13 84.56,13 85.73,11.83 M1.29 | v16.8,26.14 27.6,26.14 30.52,29.06 47.47,29.06 48.63,27.9 v50.53,27.9
  Bottom 0.279: IC2.1 8.91,55.79 10.81,53.89 10.81,36.95 15.48,36.95 16.5,37.97 IC2.9 16.65,37.97 16.8,37.83 v16.8,26.14 | v50.53,38.56 v50.53,27.9 50.53,19.13 P1.1 | v63.09,13 63.09,31.11 61.49,32.72 61.49,40.31 61.78,40.6 M2.26
PC6_PB14  (via drill 0.35)
  Top 0.279: v83.1,60.17 67.04,60.17 63.82,63.39 43.96,63.39 38.41,57.84 13.29,57.84 8.91,53.45 IC2.2 | v83.39,38.85 90.55,38.85 92.3,40.6 M2.38
  Bottom 0.279: v83.1,60.17 83.39,59.88 83.39,59.15 87.19,55.35 87.19,54.48 87.92,53.75 89.67,53.75 89.67,50.83 91.57,48.93 91.57,44.25 92.3,43.52 92.3,40.75 M2.38 | v83.39,38.85 83.39,11.83 M1.31
PC7_PB15  (via drill 0.35)
  Top 0.279: v89.67,49.66 89.53,49.51 71.27,49.51 70.1,50.68 53.16,50.68 53.16,47.47 50.53,44.84 50.53,39.73 49.66,38.85 48.63,38.85 45.13,42.35 18.84,42.35 18.55,42.06 15.63,42.06 15.04,41.48 9.64,41.48 8.91,40.75 IC2.7
  Bottom 0.279: v89.67,49.66 89.67,40.75 M2.37 89.67,40.6 89.67,39.87 88.65,38.85 88.65,24.54 84.56,20.45 84.56,8.03 82.81,8.03 82.08,8.76 82.08,9.64 81.35,10.37 81.35,11.25 80.91,11.68 M1.33
PD2_PA8  (via drill 0.35)
  Top 0.279: v87.19,34.76 62.95,34.76 61.92,33.74 18.55,33.74 18.55,38.7 16.65,40.6 IC2.10
  Bottom 0.279: v87.19,34.76 87.19,40.6 M2.36 87.19,40.75 87.19,51.12 85.88,52.43 M1.10
PD3_PA9
  Top 0.279: IC2.15 16.65,53.31 17.09,52.87 38.7,52.87 40.16,54.33 40.16,57.25 56.52,57.25 56.96,56.81 60.47,56.81 62.51,54.77 71.71,54.77 72.73,53.75 82.08,53.75 83.25,52.58 M1.12
  Bottom 0.279: M2.35 84.71,40.75 83.39,42.06 83.39,52.43 M1.12
PE0_PB4  (via drill 0.35)
  Top 0.279: v91.14,43.52 72.3,43.52 69.52,40.75 M2.29 69.37,40.6 67.62,38.85 v65.28,38.85 | v41.62,23.37 13.29,23.37 9.35,27.31 3.8,27.31 2.63,28.48 P3.3 | v62.36,36.07 v41.62,36.07
  Bottom 0.279: v91.14,43.52 91.14,13.29 92.16,12.27 92.16,10.52 90.99,9.35 M1.26 | v41.62,36.07 v41.62,23.37 | v62.36,36.07 62.36,32.72 62.95,32.13 65.28,32.13 v65.28,38.85
PE1_PB3  (via drill 0.35)
  Top 0.279: v72.15,50.39 72.44,50.68 79.01,50.68 80.77,52.43 M1.14 | v72,31.98 37.1,31.98 36.22,31.11 5.11,31.11 P3.6
  Bottom 0.279: v72.15,50.39 72.15,40.75 M2.30 72,40.6 v72,31.98
PE2_PB1
  Top 0.279: Q1.2 58.13,16.07 62.07,20.01 77.41,20.01 82.08,24.68 82.08,25.27 M2.14
  Bottom 0.279: M1.16 78.28,52.43 79.01,51.7 79.01,43.52 81.06,41.48 81.06,36.51 81.35,36.22 81.35,26.14 82.08,25.41 M2.14
PE3_PB0  (via drill 0.35)
  Top 0.279: v70.69,51.26 74.49,51.26 75.65,52.43 M1.18 | M2.13 79.6,25.41 77.84,27.16 v71.13,27.16 70.83,27.16 70.83,24.54 69.81,23.51 66.45,23.51 v66.31,23.37 | v66.31,4.09 38.85,4.09 36.07,1.31 28.19,1.31 25.7,3.8 POT2.S
  Bottom 0.279: v71.13,27.16 70.25,28.04 70.25,39.14 70.69,39.58 v70.69,51.26 | v66.31,23.37 v66.31,4.09
PE4_PB11  (via drill 0.35)
  Top 0.279: R17.1 16.94,12.12 16.65,12.41 12.27,12.41 P4.4 12.12,12.56 4.97,12.56 P5.3 | v17.09,7.74 17.23,7.59 35.2,7.59 37.97,4.82 65.87,4.82 67.18,6.13 v87.19,6.13 | v87.19,21.91 87.19,25.27 M2.16
  Bottom 0.279: P3.2 5.11,26 8.76,22.35 8.76,15.77 12.12,12.41 P4.4 | M2.16 87.34,25.41 88.07,26.14 88.07,39.14 88.36,39.43 88.36,50.83 87.05,52.14 87.05,53.75 85.88,54.91 M1.9 | v17.09,7.74 17.09,11.98 R17.1 | v87.19,21.91 v87.19,6.13
PE5_PB10
  Top 0.279: 18.91,10.44 18.4,9.93 12.27,9.93 P4.5 12.27,10.08 4.97,10.08 2.63,12.41 P5.4 | 18.91,10.44 20.45,11.98 R16.1 | M2.15 84.71,25.27 75.95,16.5 63.39,16.5 58.27,11.39 46.74,11.39 45.71,10.37 18.99,10.37 18.91,10.44
  Bottom 0.279: M2.15 84.71,25.41 85.88,26.58 85.88,50.68 84.56,51.99 84.56,53.75 83.39,54.91 M1.11 | P3.7 2.63,33.59 3.8,32.42 3.8,21.32 8.18,16.94 8.18,13.88 12.12,9.93 P4.5
PF0_PB9
  Top 0.279: M1.28 88.36,9.2 85.88,6.72 57.98,6.72 SW2.3 57.84,6.72 51.41,6.72 SW2.4
  Bottom 0.279: R3.1 45.86,11.98 51.26,6.57 SW2.4 | M2.24 56.67,40.6 55.65,39.58 55.65,10.08 57.84,7.89 57.84,6.72 SW2.3
PF1_PC13  (via drill 0.35)
  Top 0.279: M2.2 54.33,28.04 v73.17,28.04 77.26,28.04 77.55,28.33 88.36,28.33 88.36,24.54 89.38,23.51 89.53,23.51 v89.67,23.37 | v88.8,6.13 88.8,5.7 85.73,2.63 P6.2
  Bottom 0.279: v73.17,28.04 73.17,52.43 M1.20 | v88.8,6.13 89.67,7.01 v89.67,23.37
PF4_PB8  (via drill 0.35)
  Top 0.279: SW1.4 39.58,6.72 46.01,6.72 SW1.3 46.15,6.72 50.24,10.81 59.44,10.81 v60.47,11.83 73.03,11.83 M1.39
  Bottom 0.279: R1.1 42.21,11.98 39.58,9.35 39.58,6.72 SW1.4 | v60.47,11.83 60.47,26.58 60.03,27.02 60.03,40.02 59.44,40.6 M2.25
VO
  Top 0.279: POT1.S 95.22,68.2 87.34,76.09 84.12,76.09 82.81,77.41 LCD1.5

### Text on the board
tPlace: 18 | 1 | 12V | LCD G (1-16) | E | B+ | D7 | D6 | D5 | D4 | RS | VO | B+ | 5V | 5V | LCD B (3-18) | 5V | GND | GND | GND | GND | GND | 3,3V | +V | GND | 19 | 1 | 1 | 3,3V | 5V | 20 | 2 | 2 | 3TB | 5TB | 3 | 4 | 21 | 40 | 5 | 6 | 7 | 8 | 1 | 2 | 1 | 20 | 1 | 1 | PWM | LM35 | 5V | GND | 39 | 21 | 40 | 22 | 6 | 6 | HC-06 (2-5) | Placa MICROTB_UTFPR | 1 | 2 | 3 | 4 | ELE02 - 37/2020 | Made in Brazil